# Altium schematic sheet PP3_ptC_Alim.SchDoc
size A3
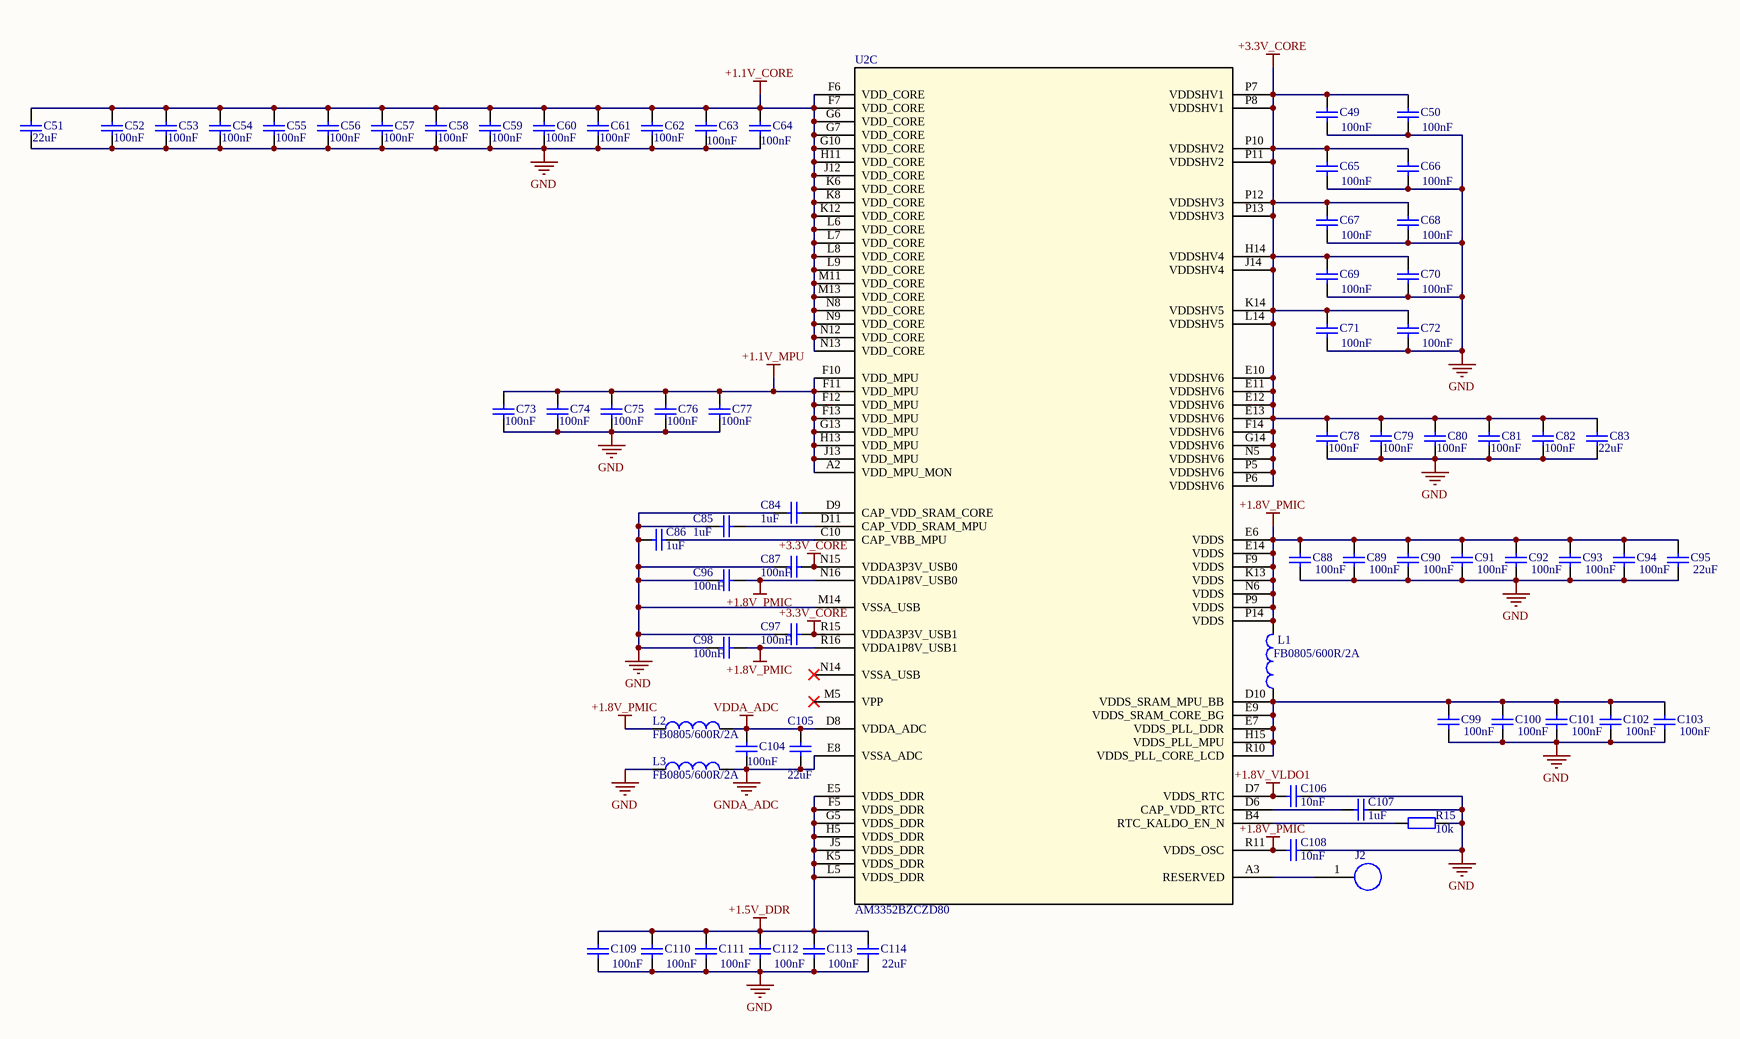
[diagram p0: PP3_ptC_Alim.SchDoc]

## Parts
C49  value 100nF  [CAPC1005X05 (0402)]  (hidden comment: Cap 100nF)
C50  value 100nF  [CAPC1005X05 (0402)]  (hidden comment: Cap 100nF)
C51  value 22uF  [0805 (2012 metric)]  (hidden comment: Cap 22uF)
C52  value 100nF  [CAPC1005X05 (0402)]  (hidden comment: Cap 100nF)
C53  value 100nF  [CAPC1005X05 (0402)]  (hidden comment: Cap 100nF)
C54  value 100nF  [CAPC1005X05 (0402)]  (hidden comment: Cap 100nF)
C55  value 100nF  [CAPC1005X05 (0402)]  (hidden comment: Cap 100nF)
C56  value 100nF  [CAPC1005X05 (0402)]  (hidden comment: Cap 100nF)
C57  value 100nF  [CAPC1005X05 (0402)]  (hidden comment: Cap 100nF)
C58  value 100nF  [CAPC1005X05 (0402)]  (hidden comment: Cap 100nF)
C59  value 100nF  [CAPC1005X05 (0402)]  (hidden comment: Cap 100nF)
C60  value 100nF  [CAPC1005X05 (0402)]  (hidden comment: Cap 100nF)
C61  value 100nF  [CAPC1005X05 (0402)]  (hidden comment: Cap 100nF)
C62  value 100nF  [CAPC1005X05 (0402)]  (hidden comment: Cap 100nF)
C63  value 100nF  [CAPC1005X05 (0402)]  (hidden comment: Cap 100nF)
C64  value 100nF  [CAPC1005X05 (0402)]  (hidden comment: Cap 100nF)
C65  value 100nF  [CAPC1005X05 (0402)]  (hidden comment: Cap 100nF)
C66  value 100nF  [CAPC1005X05 (0402)]  (hidden comment: Cap 100nF)
C67  value 100nF  [CAPC1005X05 (0402)]  (hidden comment: Cap 100nF)
C68  value 100nF  [CAPC1005X05 (0402)]  (hidden comment: Cap 100nF)
C69  value 100nF  [CAPC1005X05 (0402)]  (hidden comment: Cap 100nF)
C70  value 100nF  [CAPC1005X05 (0402)]  (hidden comment: Cap 100nF)
C71  value 100nF  [CAPC1005X05 (0402)]  (hidden comment: Cap 100nF)
C72  value 100nF  [CAPC1005X05 (0402)]  (hidden comment: Cap 100nF)
C73  value 100nF  [CAPC1005X05 (0402)]  (hidden comment: Cap 100nF)
C74  value 100nF  [CAPC1005X05 (0402)]  (hidden comment: Cap 100nF)
C75  value 100nF  [CAPC1005X05 (0402)]  (hidden comment: Cap 100nF)
C76  value 100nF  [CAPC1005X05 (0402)]  (hidden comment: Cap 100nF)
C77  value 100nF  [CAPC1005X05 (0402)]  (hidden comment: Cap 100nF)
C78  value 100nF  [CAPC1005X05 (0402)]  (hidden comment: Cap 100nF)
C79  value 100nF  [CAPC1005X05 (0402)]  (hidden comment: Cap 100nF)
C80  value 100nF  [CAPC1005X05 (0402)]  (hidden comment: Cap 100nF)
C81  value 100nF  [CAPC1005X05 (0402)]  (hidden comment: Cap 100nF)
C82  value 100nF  [CAPC1005X05 (0402)]  (hidden comment: Cap 100nF)
C83  value 22uF  [0805 (2012 metric)]  (hidden comment: Cap 22uF)
C84  value 1uF  [CAPC1608X08]  (hidden comment: Cap 1uF)
C85  value 1uF  [CAPC1608X08]  (hidden comment: Cap 1uF)
C86  value 1uF  [CAPC1608X08]  (hidden comment: Cap 1uF)
C87  value 100nF  [CAPC1005X05 (0402)]  (hidden comment: Cap 100nF)
C88  value 100nF  [CAPC1005X05 (0402)]  (hidden comment: Cap 100nF)
C89  value 100nF  [CAPC1005X05 (0402)]  (hidden comment: Cap 100nF)
C90  value 100nF  [CAPC1005X05 (0402)]  (hidden comment: Cap 100nF)
C91  value 100nF  [CAPC1005X05 (0402)]  (hidden comment: Cap 100nF)
C92  value 100nF  [CAPC1005X05 (0402)]  (hidden comment: Cap 100nF)
C93  value 100nF  [CAPC1005X05 (0402)]  (hidden comment: Cap 100nF)
C94  value 100nF  [CAPC1005X05 (0402)]  (hidden comment: Cap 100nF)
C95  value 22uF  [0805 (2012 metric)]  (hidden comment: Cap 22uF)
C96  value 100nF  [CAPC1005X05 (0402)]  (hidden comment: Cap 100nF)
C97  value 100nF  [CAPC1005X05 (0402)]  (hidden comment: Cap 100nF)
C98  value 100nF  [CAPC1005X05 (0402)]  (hidden comment: Cap 100nF)
C99  value 100nF  [CAPC1005X05 (0402)]  (hidden comment: Cap 100nF)
C100  value 100nF  [CAPC1005X05 (0402)]  (hidden comment: Cap 100nF)
C101  value 100nF  [CAPC1005X05 (0402)]  (hidden comment: Cap 100nF)
C102  value 100nF  [CAPC1005X05 (0402)]  (hidden comment: Cap 100nF)
C103  value 100nF  [CAPC1005X05 (0402)]  (hidden comment: Cap 100nF)
C104  value 100nF  [CAPC1005X05 (0402)]  (hidden comment: Cap 100nF)
C105  value 22uF  [0805 (2012 metric)]  (hidden comment: Cap 22uF)
C106  value 10nF  [CAPC1005X05 (0402)]  (hidden comment: Cap 10uF)
C107  value 1uF  [CAPC1608X08]  (hidden comment: Cap 1uF)
C108  value 10nF  [CAPC1005X05 (0402)]  (hidden comment: Cap 10uF)
C109  value 100nF  [CAPC1005X05 (0402)]  (hidden comment: Cap 100nF)
C110  value 100nF  [CAPC1005X05 (0402)]  (hidden comment: Cap 100nF)
C111  value 100nF  [CAPC1005X05 (0402)]  (hidden comment: Cap 100nF)
C112  value 100nF  [CAPC1005X05 (0402)]  (hidden comment: Cap 100nF)
C113  value 100nF  [CAPC1005X05 (0402)]  (hidden comment: Cap 100nF)
C114  value 22uF  [0805 (2012 metric)]  (hidden comment: Cap 22uF)
J2  Pad traversant  [Pad]  (value not drawn)  (no BOM)
L1  FB0805/600R/2A  [IND2012X8]
L2  FB0805/600R/2A  [IND2012X8]
L3  FB0805/600R/2A  [IND2012X8]
R15  value 10k  [RESC1608X05]  (hidden comment: Res 10k)
U2  AM3352BZCZD80  [ZCZ324]  (part C of 4)

## Nets
+1.1V_CORE: C51.2 C52.1 C53.1 C54.1 C55.1 C56.1 C57.1 C58.1 C59.1 C60.1 C61.1 C62.1 C63.1 C64.1 U2.F6(VDD_CORE) U2.F7(VDD_CORE) U2.G6(VDD_CORE) U2.G7(VDD_CORE) U2.G10(VDD_CORE) U2.H11(VDD_CORE) U2.J12(VDD_CORE) U2.K6(VDD_CORE) U2.K8(VDD_CORE) U2.K12(VDD_CORE) U2.L6(VDD_CORE) U2.L7(VDD_CORE) U2.L8(VDD_CORE) U2.L9(VDD_CORE) U2.M11(VDD_CORE) U2.M13(VDD_CORE) U2.N8(VDD_CORE) U2.N9(VDD_CORE) U2.N12(VDD_CORE) U2.N13(VDD_CORE)
+1.1V_MPU: C73.1 C74.1 C75.1 C76.1 C77.1 U2.A2(VDD_MPU_MON) U2.F10(VDD_MPU) U2.F11(VDD_MPU) U2.F12(VDD_MPU) U2.F13(VDD_MPU) U2.G13(VDD_MPU) U2.H13(VDD_MPU) U2.J13(VDD_MPU)
+1.5V_DDR: C109.1 C110.1 C111.1 C112.1 C113.1 C114.2 U2.E5(VDDS_DDR) U2.F5(VDDS_DDR) U2.G5(VDDS_DDR) U2.H5(VDDS_DDR) U2.J5(VDDS_DDR) U2.K5(VDDS_DDR) U2.L5(VDDS_DDR)
+1.8V_PMIC: C88.1 C89.1 C90.1 C91.1 C92.1 C93.1 C94.1 C95.2 C96.2 C98.2 C108.2 L1.2 L2.1 U2.E6(VDDS) U2.E14(VDDS) U2.F9(VDDS) U2.K13(VDDS) U2.N6(VDDS) U2.N16(VDDA1P8V_USB0) U2.P9(VDDS) U2.P14(VDDS) U2.R11(VDDS_OSC) U2.R16(VDDA1P8V_USB1)
+1.8V_VLDO1: C106.2 U2.D7(VDDS_RTC)
+3.3V_CORE: C49.1 C50.1 C65.1 C66.1 C67.1 C68.1 C69.1 C70.1 C71.1 C72.1 C78.1 C79.1 C80.1 C81.1 C82.1 C83.2 C87.2 C97.2 U2.E10(VDDSHV6) U2.E11(VDDSHV6) U2.E12(VDDSHV6) U2.E13(VDDSHV6) U2.F14(VDDSHV6) U2.G14(VDDSHV6) U2.H14(VDDSHV4) U2.J14(VDDSHV4) U2.K14(VDDSHV5) U2.L14(VDDSHV5) U2.N5(VDDSHV6) U2.N15(VDDA3P3V_USB0) U2.P5(VDDSHV6) U2.P6(VDDSHV6) U2.P7(VDDSHV1) U2.P8(VDDSHV1) U2.P10(VDDSHV2) U2.P11(VDDSHV2) U2.P12(VDDSHV3) U2.P13(VDDSHV3) U2.R15(VDDA3P3V_USB1)
GND: C49.2 C50.2 C51.1 C52.2 C53.2 C54.2 C55.2 C56.2 C57.2 C58.2 C59.2 C60.2 C61.2 C62.2 C63.2 C64.2 C65.2 C66.2 C67.2 C68.2 C69.2 C70.2 C71.2 C72.2 C73.2 C74.2 C75.2 C76.2 C77.2 C78.2 C79.2 C80.2 C81.2 C82.2 C83.1 C84.1 C85.1 C86.1 C87.1 C88.2 C89.2 C90.2 C91.2 C92.2 C93.2 C94.2 C95.1 C96.1 C97.1 C98.1 C99.2 C100.2 C101.2 C102.2 C103.2 C106.1 C107.2 C108.1 C109.2 C110.2 C111.2 C112.2 C113.2 C114.1 L3.1 R15.1 U2.M14(VSSA_USB)
GNDA_ADC: C104.2 C105.1 L3.2 U2.E8(VSSA_ADC)
VDDA_ADC: C104.1 C105.2 L2.2 U2.D8(VDDA_ADC)
NetC84_2: C84.2 U2.D9(CAP_VDD_SRAM_CORE)
NetC85_2: C85.2 U2.D11(CAP_VDD_SRAM_MPU)
NetC86_2: C86.2 U2.C10(CAP_VBB_MPU)
NetC99_1: C99.1 C100.1 C101.1 C102.1 C103.1 L1.1 U2.D10(VDDS_SRAM_MPU_BB) U2.E7(VDDS_PLL_DDR) U2.E9(VDDS_SRAM_CORE_BG) U2.H15(VDDS_PLL_MPU) U2.R10(VDDS_PLL_CORE_LCD)
NetC107_1: C107.1 U2.D6(CAP_VDD_RTC)
NetJ2_1: J2.1(PAD) U2.A3(RESERVED)
NetR15_2: R15.2 U2.B4(RTC_KALDO_EN_N)

Not connected (* = marked no-connect by the designer): U2 M5(VPP)* N14(VSSA_USB)*

## Library data of the parts
C49 C50 C52-C82 C87-C94 C96-C104 C109-C113 = Cap: Capacitor; Fabricant: MULTICOMP; Fournisseur: Farnell; RefFabricant: MC0402N101J160CT; RefFournisseur: 2627387; Case: 0402 [1005 Metric]; DataSheet: http://www.farnell.com/datasheets/2117933.pdf
C51 C83 C95 C105 C114 = Cap: Capacitor; Fabricant: TDK; Fournisseur: Farnell; RefFabricant: C2012X5R0J226K125AB; RefFournisseur: 2525125; Case: 0805 [2012 Metric]; DataSheet: http://www.farnell.com/datasheets/2291921.pdf
C84-C86 C107 = Cap: Capacitor; Fabricant: MURATA; Fournisseur: Farnell; RefFabricant: GRM188F51A105ZA01D; RefFournisseur: 1828847; Case: 0603 [1608 Metric]; DataSheet: http://www.farnell.com/datasheets/2048756.pdf
C106 C108 = Cap: Capacitor; Fabricant: TDK; Fournisseur: Farnell; RefFabricant: C1005X8R1E103K050BA; RefFournisseur: 2525066; Case: 0402 [1005 Metric]; DataSheet: http://www.farnell.com/datasheets/1936795.pdf
J2 = Pad
L1-L3 = Inductor: Fabricant: TDK; Fournisseur: Farnell; RefFabricant: MPZ2012S601A; RefFournisseur: 1669753; Case: 0805 [2012 Metric]; DataSheet: http://www.farnell.com/datasheets/84904.pdf
  L1: Value: FB0805/600R/2A
R15 = Res2: Resistor; Fabricant: TE CONNECTIVITY; Fournisseur: Farnell; RefFabricant: CRGH0603J10K; RefFournisseur: 2331740; Case: 0603 [1608 Metric]; DataSheet: CRGH0603J10K
U2 = AM3352BZCZD80: Microprocesseur ARM; Fabricant: TEXAS INSTRUMENTS; Fournisseur: Olimex; RefFabricant: AM3352ZCZD72; RefFournisseur: AM3352ZCZD72; DataSheet: http://www.ti.com/lit/ds/symlink/am3352.pdf